# Altium project 串口板.PrjPcb
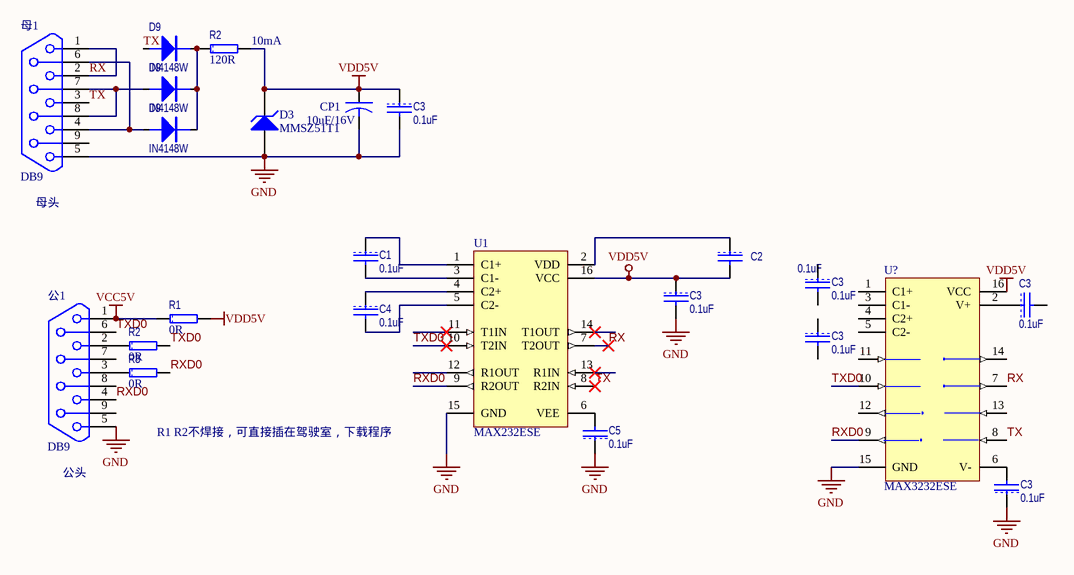
[diagram p0: 串口板第5版.SchDoc]
1 sheet, 23 parts. Net scope: global (net labels, ports and power ports of the same name join across sheets).
Board file: 串口版第5版.PcbDoc

## Sheet 串口板第5版.SchDoc
size A4

### Parts
(Parts that share a designator on the sheet are numbered #1, #2 ... from top to bottom, then left to right.)
C1  0.1uF  [1608[0603]]
C2  0.1uF  [1608[0603]]
C3#1  0.1uF  [1608[0603]]
C3#2  0.1uF  [1608[0603]]
C3#3  0.1uF  [1608[0603]]
C3#4  0.1uF  [1608[0603]]
C3#5  0.1uF  [1608[0603]]
C3#6  0.1uF  [1608[0603]]
C4  0.1uF  [1608[0603]]
C5  0.1uF  [1608[0603]]
CP1  10uF/16V  [3216[1206]]
D3  MMSZ51T1  [425]
D9#1  IN4148W  [SOD123]
D9#2  IN4148W  [SOD123]
D9#3  IN4148W  [SOD123]
R1  0R  [0603RT]
R2#1  120R  [0603RT]
R2#2  0R  [0603RT]
R3  0R  [0603RT]
U1#1  MAX232ESE  [SOIC16_N]
U1#2  MAX3232ESE  [NSO16_N]
母1  DB9  [DB9BSM]
公1  DB9  [DB9BSM]

### Nets
GND: C3#1.2 C3#3.2 C3#6.1 C5.1 CP1.2 D3.2(A) U1#1.15(GND) U1#2.15(GND) 母1.5 公1.5
VCC5V: R1.1 公1.1
VDD5V: C2.2 C3#1.1 C3#3.1 CP1.1 D3.1(K) R1.2 R2#1.2 U1#1.16(VCC) U1#2.16(VCC)
RX: U1#1.7(T2OUT) U1#2.7(T2OUT) 母1.1 母1.2
RXD0: R3.2 U1#1.9(R2OUT) U1#2.9(R2OUT) 公1.4
TX: D9#1.1 U1#1.8(R2IN) U1#2.8(R2IN) 母1.3
TXD0: R2#2.2 U1#1.10(T2IN) U1#2.10(T2IN) 公1.6
NetC1_1: C1.1 U1#1.1(C1+)
NetC1_2: C1.2 U1#1.3(C1-)
NetC2_1: C2.1 U1#1.2(VDD)
NetC3#4_1: C3#4.1 U1#2.2(V+)
NetC3#6_2: C3#6.2 U1#2.6(V-)
NetC4_1: C4.1 U1#1.4(C2+)
NetC4_2: C4.2 U1#1.5(C2-)
NetC5_2: C5.2 U1#1.6(VEE)
NetD9#1_2: D9#1.2 D9#2.2 D9#3.2 R2#1.1
NetD9#2_1: D9#2.1 母1.7 母1.8
NetD9#3_1: D9#3.1 母1.4 母1.6
NetR2#2_1: R2#2.1 公1.2
NetR3_1: R3.1 公1.3

Not connected (* = marked no-connect by the designer): C3#2 1 2; C3#4 2; C3#5 1 2; U1#1 11(T1IN)* 12(R1OUT) 13(R1IN)* 14(T1OUT)*; U1#2 1(C1+) 3(C1-) 4(C2+) 5(C2-) 11(T1IN) 12(R1OUT) 13(R1IN) 14(T1OUT); 母1 9; 公1 7 8 9

### Notes on the sheet
- (near R2#1) 10mA
- (near 母1) 母头
- (near 公1) 公头
- R1 R2不焊接，可直接插在驾驶室，下载程序

### Library data of the parts
C1 C2 C3#1-C3#6 C4 C5 = CAP: Capacitor
CP1 = CAPACITOR: Tantalum Capacitor; Compy: TAJ; name: TAJ-A-106-M-010-R
D3 = MMSZ51T1: Surface Mount Silicon Zener Diode; Published: 29-Sep-2000; LatestRevisionDate: 19-Mar-2004; LatestRevisionNote: Silkscreen size reduced; PCB footprint pad transposed.; PackageVersion: 1988; PackageReference: 425; Publisher: Altium Limited; PackageDescription: SOD-123; 2 Leads; Body 2.7 x 1.6 mm, (LxW); ComponentLink1Description: Manufacturer Link; ComponentLink1URL: http://www.onsemi.com/site/products/landing?taxonomyID=194; ComponentLink2Description: Datasheet; ComponentLink2URL: http://www.onsemi.com/pub/Collateral/MMSZ2V4T1-D.PDF
D9#1-D9#3 = DIODE
R1 R2#2 R3 = RES: Manufacturer: vishay; Model: RT0603DRD7D0RL; Value: 0R; Type: 无铅电阻
R2#1 = RES: Manufacturer: vishay; Model: RT0603DRD7D120RL; Value: 120R; Type: 无铅电阻
U1#1 = MAX232ESE: +5V Powered, Multi-Channel RS-232 Driver/Receiver; Published: 16-Jan-2001; LatestRevisionDate: 13-Apr-2006; LatestRevisionNote: IPC-7351 Footprint Added.; PackageReference: NSO16; Publisher: Altium Limited; PackageDescription: 16-Pin Small Outline Integrated Circuit 1.27 mm Pitch; Code_JEDEC: MS-012-AC; Code_IPC: SOIC127P600-16; ComponentLink1Description: Manufacturer Link; ComponentLink1URL: http://www.maxim-ic.com/; ComponentLink2Description: Datasheet; ComponentLink2URL: http://pdfserv.maxim-ic.com/en/ds/MAX220-MAX249.pdf; Supplier 1: Digi-Key; Supplier Part Number 1: MAX232ESE+T-ND
U1#2 = MAX3232ESE: 3.0V TO 5.5V, Low-Power, up to 1Mbps, True RS-232 Transceiver Using Four 0.1µF External Capacitor; Published: 16-Jan-2001; LatestRevisionDate: 13-Apr-2006; LatestRevisionNote: IPC-7351 Footprint Added.; DatasheetVersion: Mar-1999; PackageReference: NSO16; Publisher: Altium Limited; PackageDescription: 16-Pin Small Outline Integrated Circuit 1.27 mm Pitch; Code_JEDEC: MS-012-AC; Code_IPC: SOIC127P600-16; ComponentLink1Description: Manufacturer Link; ComponentLink1URL: http://www.maxim-ic.com/; ComponentLink2Description: Datasheet; ComponentLink2URL: http://pdfserv.maxim-ic.com/en/ds/MAX3222-MAX3241.pdf